# Altium project Dashboard.PrjPcb
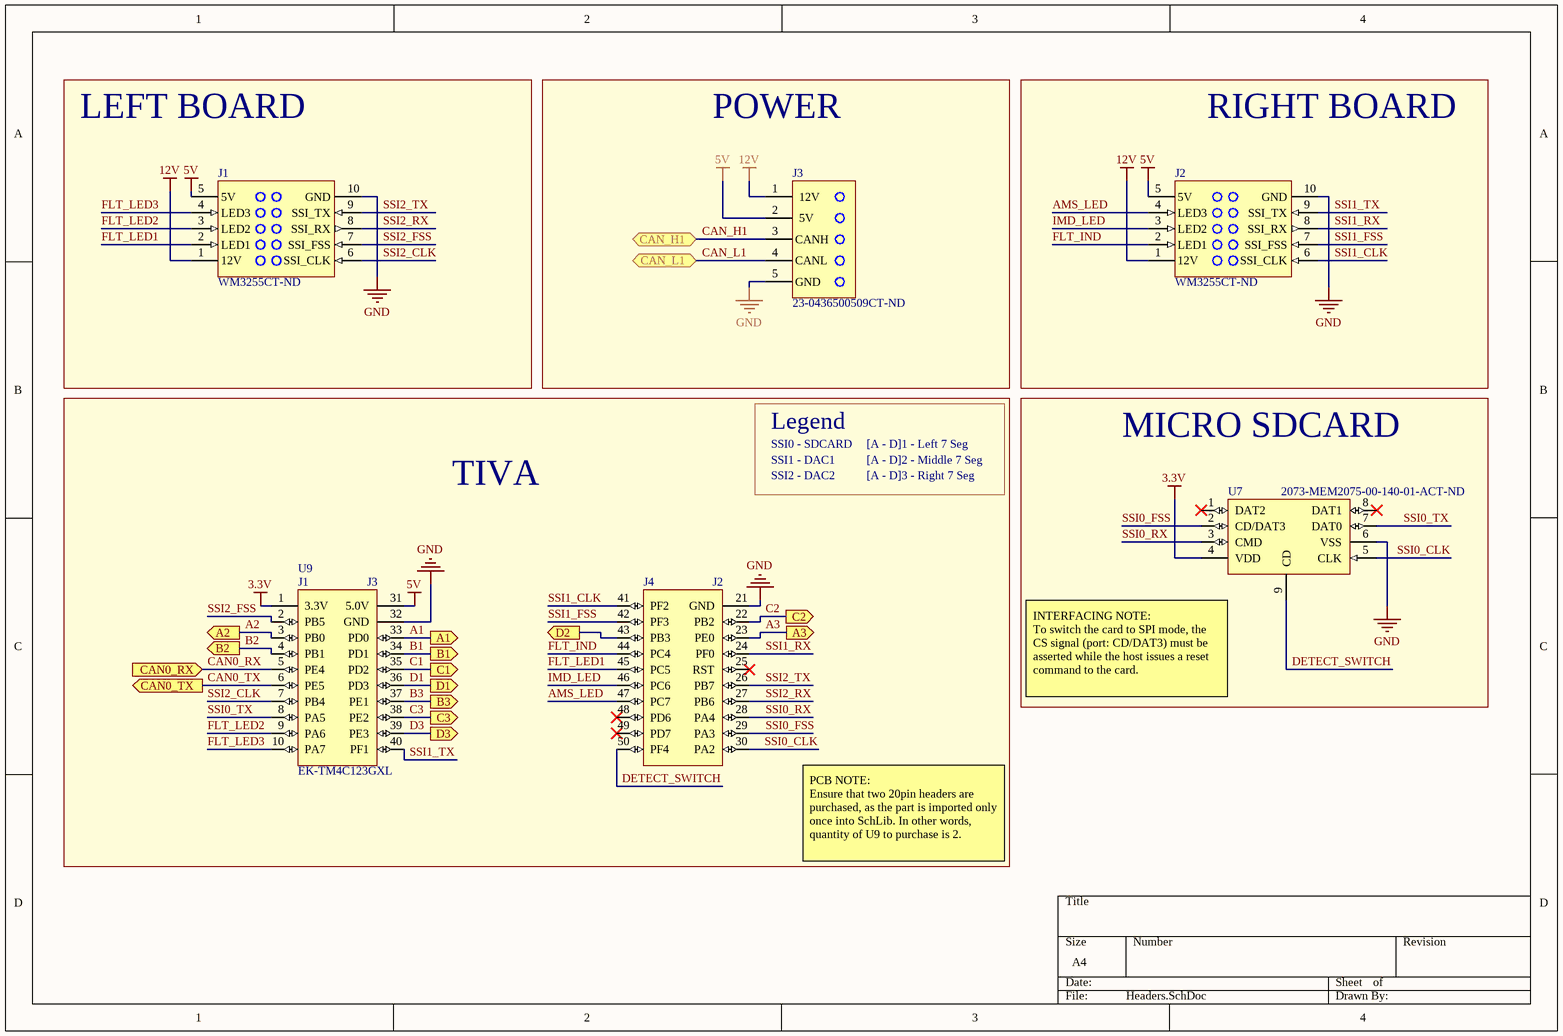
[diagram p0: Headers.SchDoc]
3 sheets, 41 parts. Net scope: global (net labels, ports and power ports of the same name join across sheets).
Board file: Dashboard.PcbDoc
Sheets:
  Headers.SchDoc
  CANTransceiver.SchDoc
  7SegDisplay.SchDoc

## Sheet Headers.SchDoc
size A4

### Parts
J1  WM3255CT-ND  [MOLEX-10PIN]
J2  WM3255CT-ND  [MOLEX-10PIN]
J3  23-0436500509CT-ND  [MOLEX-5PIN]
U7  2073-MEM2075-00-140-01-ACT-ND  [SDCARD-NORMAL]
U9  EK-TM4C123GXL  [TIVA Headers]

### Blocks framed on the sheet
LEFT BOARD: J1
POWER: J3
RIGHT BOARD: J2
TIVA: U9
MICRO SDCARD: U7

### Ports
A1 (out), A2 (out), A3 (out), B1 (out), B2 (out), B3 (out), C1 (out), C2 (out), C3 (out), CAN0_RX (in), CAN0_TX (out), CAN_H1 (bidir), CAN_L1 (bidir), D1 (out), D2 (out), D3 (out)

### Nets
3.3V: U7.4(VDD) U9.1(3.3V)
5V: J1.5(5V) J2.5(5V) J3.2(5V) U9.31(5.0V)
12V: J1.1(12V) J2.1(12V) J3.1(12V)
GND: J1.10(GND) J2.10(GND) J3.5(GND) U7.6(VSS) U9.21(GND) U9.32(GND)
A1: U9.33(PD0) ; port A1
A2: U9.3(PB0) ; port A2
A3: U9.23(PE0) ; port A3
AMS_LED: J2.4(LED3) U9.47(PC7)
B1: U9.34(PD1) ; port B1
B2: U9.4(PB1) ; port B2
B3: U9.37(PE1) ; port B3
C1: U9.35(PD2) ; port C1
C2: U9.22(PB2) ; port C2
C3: U9.38(PE2) ; port C3
CAN0_RX: U9.5(PE4) ; port CAN0_RX
CAN0_TX: U9.6(PE5) ; port CAN0_TX
CAN_H1: J3.3(CANH) ; port CAN_H1
CAN_L1: J3.4(CANL) ; port CAN_L1
D1: U9.36(PD3) ; port D1
D2: U9.43(PB3) ; port D2
D3: U9.39(PE3) ; port D3
DETECT_SWITCH: U7.9(CD) U9.50(PF4)
FLT_IND: J2.2(LED1) U9.44(PC4)
FLT_LED1: J1.2(LED1) U9.45(PC5)
FLT_LED2: J1.3(LED2) U9.9(PA6)
FLT_LED3: J1.4(LED3) U9.10(PA7)
IMD_LED: J2.3(LED2) U9.46(PC6)
SSI0_CLK: U7.5(CLK) U9.30(PA2)
SSI0_FSS: U7.2(CD/DAT3) U9.29(PA3)
SSI0_RX: U7.3(CMD) U9.28(PA4)
SSI0_TX: U7.7(DAT0) U9.8(PA5)
SSI1_CLK: J2.6(SSI_CLK) U9.41(PF2)
SSI1_FSS: J2.7(SSI_FSS) U9.42(PF3)
SSI1_RX: J2.8(SSI_RX) U9.24(PF0)
SSI1_TX: J2.9(SSI_TX) U9.40(PF1)
SSI2_CLK: J1.6(SSI_CLK) U9.7(PB4)
SSI2_FSS: J1.7(SSI_FSS) U9.2(PB5)
SSI2_RX: J1.8(SSI_RX) U9.27(PB6)
SSI2_TX: J1.9(SSI_TX) U9.26(PB7)

Not connected (* = marked no-connect by the designer): U7 1(DAT2)* 8(DAT1)*; U9 25(RST)* 48(PD6)* 49(PD7)*

### Notes on the sheet
- SSI0 - SDCARD
- Legend
- [A - D]1 - Left 7 Seg
- SSI1 - DAC1
- SSI2 - DAC2
- [A - D]2 - Middle 7 Seg
- [A - D]3 - Right 7 Seg
- (near U7) INTERFACING NOTE:
  To switch the card to SPI mode, the CS signal (port: CD/DAT3) must be asserted while the host issues a reset command to the card.
- PCB NOTE:
  Ensure that two 20pin headers are purchased, as the part is imported only once into SchLib. In other words, quantity of U9 to purchase is 2.
- (in symbol PH2-20-UA) J1; J3; J4; J2

### Library data of the parts
J1 J2 = MOLEX-10PIN: HEADER R/A 10POS DUAL TIN SMD; Manufacturer: Molex; Manufacturer Part Number: 0430451006; Contact Resistance: 10mR; Number of Positions: 10; Connector Type: Male Pin; Pitch: 3mm; Row Spacing: 0.118inch; Supplier 1: Digi-Key; Stock 1: 2460; Pricing 1: 1=3.72000, 10=3.57200, 100=2.97680 (USD); RoHS: Yes; Mount: Surface Mount; Contact Plating: Tin; Contact Material: Brass; Color: Black; Housing Material: Polymer; Housing Color: Black; Min Operating Temperature: -40°C; Max Operating Temperature: 105°C; Number of Rows: 2; Packaging: Tape and Reel; Termination: Solder; Number of Contacts: 10; Orientation: Right Angle; Fastening Type: Latch; Length: 19.15mm; Depth: 15.4mm; ComponentLink1URL: https://datasheet.ciiva.com/737/430450407-sd-737953.pdf?src-supplier=Digi-Key; ComponentLink1Description: https://datasheet.ciiva.com/737/430450407-sd-737953.pdf?src-supplier=Digi-Key; Supplier Part Number 1: WM3255CT-ND
J3 = 0436500509: GLOVE, POLYAMIDE, L/FREE, PU, SIZE 6 - More Details; Manufacturer: Molex; Max Voltage Rating (AC): 250V; Number of Contacts: 5; Current Rating: 5A; Voltage Rating: 600V; Gender: Male; Connector Type: Male Pin; Pitch: 3mm; Glow Wire Compliant: Compliant; Supplier 1: Digi-Key; Manufacturer Part Number: 0436500509; Stock 1: 8420; Pricing 1: 1=2.58000, 10=2.34500, 100=2.00970 (USD); RoHS: Yes; Mount: Surface Mount; Contact Plating: Tin; Contact Material: Brass; Color: Black; Housing Color: Black; Housing Material: Polymer; Min Operating Temperature: -40°C; Max Operating Temperature: 105°C; Termination: Solder; Orientation: Right Angle; Number of Rows: 1; Packaging: Tape and Reel; Package Quantity: 10; Fastening Type: Ramp; Contact Gender: Male; Number of Positions: 5; Voltage Rating (DC): 250V; Number of Circuits: 5; Halogen Free: Low Halogen; ComponentLink1URL: https://datasheet.ciiva.com/712/436501209-sd-712211.pdf?src-supplier=Digi-Key; ComponentLink1Description: https://datasheet.ciiva.com/712/436501209-sd-712211.pdf?src-supplier=Digi-Key; ComponentLink2URL: https://datasheet.ciiva.com/16089/0436500509-pcb-headers-16089055.pdf?src-supplier=Onlinecomponents.com; ComponentLink2Description: https://datasheet.ciiva.com/16089/0436500509-pcb-headers-16089055.pdf?src-supplier=Onlinecomponents.com; Supplier Part Number 1: 23-0436500509CT-ND
U7 = SDCARD CONN.: 850NM POINT SOURCE LED ASSY; Manufacturer: Global Connector Technology; Supplier 1: Newark; Manufacturer Part Number: MEM2075-00-140-01-A; Stock 1: 1028; Pricing 1: 1=1.68000, 10=1.53000, 25=1.53000, 50=1.53000, 100=1.42000, 250=1.42000, 500=1.32000, 1000=1.23000, 1=1.26000, 10=1.15000, 25=1.15000, 50=1.15000, 100=1.07000, 250=1.07000, 500=0.98600, 1000=0.92000 (CAD); RoHS: No; Supplier Part Number 1: 56AC1963
U9 = PH2-20-UA: PH Series 20 Position Through-Hole Dual Row Straight .100 Header; Manufacturer: Adam Equipment; Number of Positions: 20; Pitch: 2.54mm; Supplier 1: Digi-Key; Manufacturer Part Number: PH2-20-UA; Stock 1: 6280; Pricing 1: 1=0.26000, 10=0.24700, 100=0.17300, 500=0.14826, 1000=0.12355, 5000=0.10590, 10000=0.09884 (USD); RoHS: Yes; Mount: Through Hole; Contact Plating: Gold; Termination: Solder; Packaging: Bag; Lead Free: Lead Free; ComponentLink1URL: https://datasheet.ciiva.com/16479/page-312-315-16479356.pdf?src-supplier=Future+Electronics; ComponentLink1Description: https://datasheet.ciiva.com/16479/page-312-315-16479356.pdf?src-supplier=Future+Electronics; Supplier Part Number 1: 2057-PH2-20-UA-ND

## Sheet CANTransceiver.SchDoc
size A4
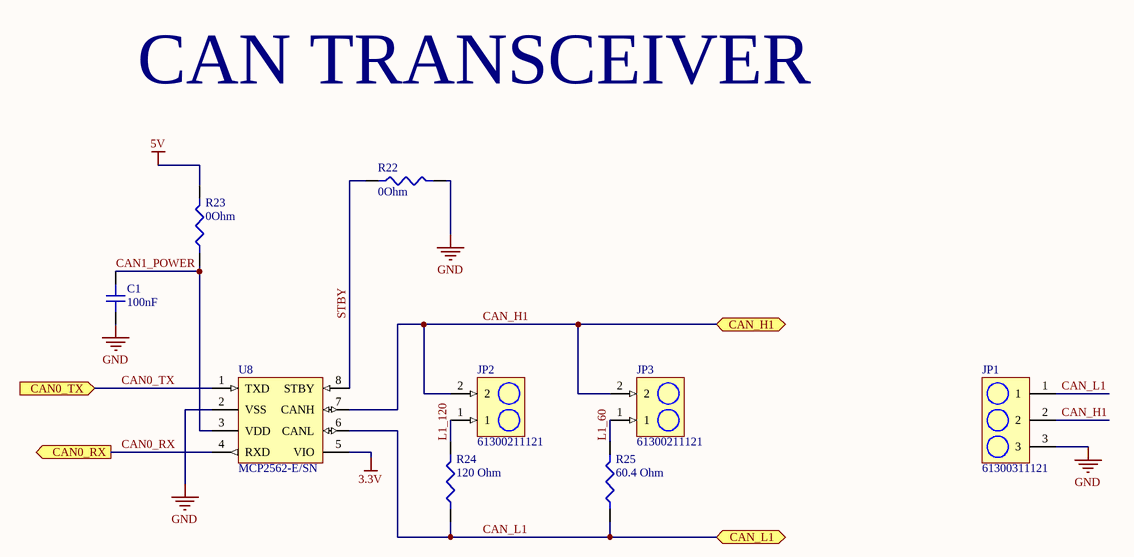
[diagram p1: CANTransceiver.SchDoc]

### Parts
C1  100nF  [CAPC1608X10N]
JP1  61300311121  [61300311121]
JP2  61300211121  [61300211121]
JP3  61300211121  [61300211121]
R22  0Ohm  [RES-0603]
R23  0Ohm  [RES-0603]
R24  120 Ohm  [RESC1608X06N]
R25  60.4 Ohm  [60.4 OHM RES 0603]
U8  MCP2562-E/SN  [SOIC127P600X175-8N]

### Ports
CAN0_RX (out), CAN0_TX (in), CAN_H1 (bidir), CAN_L1 (bidir)

### Nets
3.3V: U8.5(VIO)
5V: R23.2
GND: C1.1 JP1.3 R22.2 U8.2(VSS)
CAN0_RX: U8.4(RXD) ; port CAN0_RX
CAN0_TX: U8.1(TXD) ; port CAN0_TX
CAN1_POWER: C1.2 R23.1 U8.3(VDD)
CAN_H1: JP1.2 JP2.2 JP3.2 U8.7(CANH) ; port CAN_H1
CAN_L1: JP1.1 R24.1 R25.1 U8.6(CANL) ; port CAN_L1
L1_60: JP3.1 R25.2
L1_120: JP2.1 R24.2
STBY: R22.1 U8.8(STBY)

### Notes on the sheet
- CAN TRANSCEIVER

### Library data of the parts
C1 = C0603C104K4RAC7411: Cap Ceramic 0.1uF 16V X7R 10% SMD 0603 125C Paper T/R; Manufacturer: KEMET; Dissipation Factor: 3.5%; Supplier 1: Digi-Key; Manufacturer Part Number: C0603C104K4RAC7411; Stock 1: 26049; Pricing 1: 1=0.14000, 10=0.09800, 100=0.04620, 500=0.03240, 1000=0.02683, 2500=0.02497, 5000=0.02285 (USD); RoHS: Yes; Mount: Surface Mount; Case/Package: 0603; Case Code (Imperial): 0603; Case Code (Metric): 1608; Dielectric Material: Ceramic; Min Operating Temperature: -55°C; Max Operating Temperature: 125°C; Tolerance: 10%; Packaging: Tape and Reel; Capacitance: 100nF; Package Quantity: 10000; Voltage Rating: 16V; Voltage Rating (DC): 16V; Dielectric: X7R; Termination: SMD/SMT; Length: 1.6mm; Height: 0.8mm; Width: 0.8mm; Lead Pitch: 0.7mm; Depth: 0.8mm; Radiation Hardening: No; ComponentLink1URL: https://datasheet.ciiva.com/5411/kem-c1002-x7r-smd-357932-5411657.pdf?src-supplier=Mouser; ComponentLink1Description: https://datasheet.ciiva.com/5411/kem-c1002-x7r-smd-357932-5411657.pdf?src-supplier=Mouser; Supplier Part Number 1: 399-17393-1-ND
JP1 = 61300311121: WURTH ELEKTRONIK - 61300311121 - HEADER, 2.54MM, PIN, THT, VERTICAL, 3WAY; Manufacturer: Wurth Electronics; Number of Positions: 3; Gender: Male; Connector Type: Male Pin; Pitch: 0.1inch; Supplier 1: Digi-Key; Manufacturer Part Number: 61300311121; Stock 1: 56311; Pricing 1: 1=0.13000, 10=0.10600, 25=0.08800, 50=0.07400, 100=0.06700, 1000=0.06100 (USD); RoHS: Yes; Mount: Through Hole; Contact Plating: Gold; Contact Material: Copper; Color: Black; Number of Rows: 1; Packaging: Bulk; Termination: Solder; Number of Contacts: 3; Contact Mating Length: 0.236inch; REACH SVHC: Unknown; Lead Free: Lead Free; ComponentLink1URL: http://www.farnell.com/cad/1737268.pdf?src-supplier=Element14; ComponentLink1Description: http://www.farnell.com/cad/1737268.pdf?src-supplier=Element14; ComponentLink2URL: https://katalog.we-online.de/em/datasheet/6130xx11121.pdf?src-supplier=Digi-Key; ComponentLink2Description: https://katalog.we-online.de/em/datasheet/6130xx11121.pdf?src-supplier=Digi-Key; Supplier Part Number 1: 732-5316-ND
JP2 JP3 = 61300211121: Headers & Wire Housings WR-PHD 2.54mm 2Pin THT Header; Manufacturer: Wurth Electronics; Current Rating: 3A; Voltage Rating: 250V; Number of Positions: 2; Gender: Male; Connector Type: Male Pin; Pitch: 0.1inch; Supplier 1: Digi-Key; Manufacturer Part Number: 61300211121; Stock 1: 191551; Pricing 1: 1=0.13000, 10=0.10600, 25=0.08800, 50=0.07400, 100=0.06700, 1000=0.06100 (USD); RoHS: Yes; Mount: Through Hole; Contact Plating: Gold; Housing Material: PBT; Contact Material: Copper Alloy,Copper; Color: Black; Min Operating Temperature: -40°C; Max Operating Temperature: 125°C; Number of Rows: 1; Contact Gender: Male; Packaging: Bulk; Termination: Through Hole; Number of Contacts: 2; Contact Mating Length: 0.236inch; REACH SVHC: Unknown; Lead Free: Lead Free; ComponentLink1URL: https://datasheet.ciiva.com/13619/6130xx11121-48870-13619345.pdf?src-supplier=Mouser; ComponentLink1Description: https://datasheet.ciiva.com/13619/6130xx11121-48870-13619345.pdf?src-supplier=Mouser; Supplier Part Number 1: 732-5315-ND
R22 R23 = RC0603JR-070RL: RES SMD 0 OHM JUMPER 1/10W 0603; Manufacturer: Yageo; Resistance: 0mR; Tolerance: 1%; Voltage Rating: 50V; Power Rating: 100mW; Temperature Coefficient: 200ppm/°C; Supplier 1: Digi-Key; Manufacturer Part Number: RC0603JR-070RL; Stock 1: 36135548; Pricing 1: 1=0.10000, 10=0.01900, 25=0.01360, 50=0.01040, 100=0.00770, 250=0.00588, 500=0.00472, 1000=0.00347 (USD); RoHS: Yes; Case/Package: 0603; Number of Pins: 2; Case Code (Imperial): 0603; Case Code (Metric): 1608; Contact Plating: Tin,Matte; Min Operating Temperature: -55°C; Max Operating Temperature: 155°C; Package Quantity: 5000; Packaging: Tape and Reel; Voltage Rating (DC): 50V; Termination: SMD/SMT; Composition: Thick Film; Military Standard: Not; Length: 1.6mm; Height: 0.45mm; Width: 0.8mm; Depth: 0.8mm; Radiation Hardening: No; REACH SVHC: No SVHC; Lead Free: Lead Free; ComponentLink1URL: https://datasheet.ciiva.com/11808/pyu-r-int-6-11808700.pdf?src-supplier=RSComponents; ComponentLink1Description: https://datasheet.ciiva.com/11808/pyu-r-int-6-11808700.pdf?src-supplier=RSComponents; ComponentLink2URL: https://datasheet.ciiva.com/7746/1738695-7746421.pdf?src-supplier=Element14; ComponentLink2Description: https://datasheet.ciiva.com/7746/1738695-7746421.pdf?src-supplier=Element14; ComponentLink3URL: https://datasheet.ciiva.com/8883/pyu-rc0603-51-rohs-l-4-8883045.pdf?src-supplier=Avnet; ComponentLink3Description: https://datasheet.ciiva.com/8883/pyu-rc0603-51-rohs-l-4-8883045.pdf?src-supplier=Avnet; ComponentLink4URL: https://datasheet.ciiva.com/15189/getdatasheetpartid-329462-15189845.pdf?src-supplier=Verical; ComponentLink4Description: https://datasheet.ciiva.com/15189/getdatasheetpartid-329462-15189845.pdf?src-supplier=Verical; ComponentLink5URL: https://datasheet.ciiva.com/7746/1738695-7746422.pdf?src-supplier=Element14; ComponentLink5Description: https://datasheet.ciiva.com/7746/1738695-7746422.pdf?src-supplier=Element14; ComponentLink6URL: https://datasheet.ciiva.com/12555/rc0603-272842-12555254.pdf?src-supplier=Mouser; ComponentLink6Description: https://datasheet.ciiva.com/12555/rc0603-272842-12555254.pdf?src-supplier=Mouser; ComponentLink7URL: https://datasheet.ciiva.com/22747/443971-22747530.pdf?src-supplier=Element14; ComponentLink7Description: https://datasheet.ciiva.com/22747/443971-22747530.pdf?src-supplier=Element14; Supplier Part Number 1: 311-0.0GRCT-ND
R24 = ERA-3AEB121V: Metal film resistor 120 Ω SMD 0603 0.1 W; Manufacturer: Panasonic; Resistance: 120R; Power Rating: 100mW; Tolerance: 0.1%; Voltage Rating: 75V; Temperature Coefficient: 25ppm/°C; Supplier 1: Digi-Key; Manufacturer Part Number: ERA-3AEB121V; Stock 1: 121177; Pricing 1: 1=0.35000, 10=0.30000, 100=0.11730, 1000=0.04908, 2500=0.04499 (USD); RoHS: Yes; Mount: Surface Mount; Case/Package: 0603; Number of Pins: 2; Case Code (Metric): 1608; Case Code (Imperial): 0603; Contact Plating: Tin; Min Operating Temperature: -55°C; Max Operating Temperature: 155°C; Packaging: Tape and Reel; Package Quantity: 1; Composition: Thin Film; Number of Terminations: 2; Termination: SMD/SMT; Military Standard: Not; Max Power Dissipation: 100mW; Voltage Rating (DC): 75V; Features: Automotive AEC-Q200; Length: 1.6mm; Height: 0.45mm; Width: 0.8mm; Depth: 0.8mm; Radiation Hardening: No; REACH SVHC: No SVHC; Lead Free: Lead Free; ComponentLink1URL: https://datasheet.ciiva.com/11808/0900766b80fe20f7-11808026.pdf?src-supplier=RSComponents; ComponentLink1Description: https://datasheet.ciiva.com/11808/0900766b80fe20f7-11808026.pdf?src-supplier=RSComponents; ComponentLink2URL: https://datasheet.ciiva.com/22737/1776116-22737254.pdf?src-supplier=Element14; ComponentLink2Description: https://datasheet.ciiva.com/22737/1776116-22737254.pdf?src-supplier=Element14; ComponentLink3URL: https://datasheet.ciiva.com/30214/54aoa0000ce26-30214359.pdf?src-supplier=Onlinecomponents.com; ComponentLink3Description: https://datasheet.ciiva.com/30214/54aoa0000ce26-30214359.pdf?src-supplier=Onlinecomponents.com; ComponentLink4URL: https://datasheet.ciiva.com/48425/era-eng-tds-48425415.pdf?src-supplier=Distrelec; ComponentLink4Description: https://datasheet.ciiva.com/48425/era-eng-tds-48425415.pdf?src-supplier=Distrelec; ComponentLink5URL: https://datasheet.ciiva.com/5999/485442-5999048.pdf?src-supplier=Farnell; ComponentLink5Description: https://datasheet.ciiva.com/5999/485442-5999048.pdf?src-supplier=Farnell; ComponentLink6URL: https://datasheet.ciiva.com/43455/485442-43455209.pdf?src-supplier=Farnell; ComponentLink6Description: https://datasheet.ciiva.com/43455/485442-43455209.pdf?src-supplier=Farnell; ComponentLink7URL: https://datasheet.ciiva.com/43457/485442-43457753.pdf?src-supplier=Farnell; ComponentLink7Description: https://datasheet.ciiva.com/43457/485442-43457753.pdf?src-supplier=Farnell; ComponentLink8URL: https://datasheet.ciiva.com/48534/era-eng-tds-48534505.pdf?src-supplier=Distrelec; ComponentLink8Description: https://datasheet.ciiva.com/48534/era-eng-tds-48534505.pdf?src-supplier=Distrelec; ComponentLink9URL: https://datasheet.ciiva.com/5999/485442-5999050.pdf?src-supplier=Farnell; ComponentLink9Description: https://datasheet.ciiva.com/5999/485442-5999050.pdf?src-supplier=Farnell; ComponentLink10URL: https://datasheet.ciiva.com/9117/aoa0000ce26-9117338.pdf?src-supplier=Avnet; ComponentLink10Description: https://datasheet.ciiva.com/9117/aoa0000ce26-9117338.pdf?src-supplier=Avnet; ComponentLink11URL: https://datasheet.ciiva.com/9186/aoa0000ce26-9186155.pdf?src-supplier=Avnet; ComponentLink11Description: https://datasheet.ciiva.com/9186/aoa0000ce26-9186155.pdf?src-supplier=Avnet; Supplier Part Number 1: P120DBCT-ND
R25 = RMCF0603FT60R4: RES 60.4 OHM 1% 1/10W 0603; Manufacturer: Stackpole Electronics; Resistance: 60.4R; Max Power Dissipation: 100mW; Temperature Coefficient: 100ppm/°C; Supplier 1: Digi-Key; Manufacturer Part Number: RMCF0603FT60R4; Stock 1: 27338; Pricing 1: 1=0.10000, 10=0.01600, 100=0.00650, 1000=0.00292, 2500=0.00253 (USD); RoHS: Yes; Mount: Surface Mount; Case/Package: 0603; Case Code (Metric): 1608; Case Code (Imperial): 0603; Contact Plating: Tin,Matte; Min Operating Temperature: -55°C; Max Operating Temperature: 155°C; Packaging: Tape and Reel; Tolerance: 1%; Composition: Thick Film; Number of Terminations: 2; Features: Automotive AEC-Q200; Length: 0.061inch; Height: 0.022inch; Width: 0.031inch; Radiation Hardening: No; Lead Free: Lead Free; ComponentLink1URL: http://components.arrow.com/part/dataview/50499519S121523N1174?src-supplier=Arrow; ComponentLink1Description: http://components.arrow.com/part/dataview/50499519S121523N1174?src-supplier=Arrow; ComponentLink2URL: https://www.seielect.com/catalog/SEI-RMCF_RMCP.pdf?src-supplier=Avnet; ComponentLink2Description: https://www.seielect.com/catalog/SEI-RMCF_RMCP.pdf?src-supplier=Avnet; ComponentLink3URL: https://www.seielect.com/catalog/SEI-Packaging.pdf?src-supplier=Digi-Key; ComponentLink3Description: https://www.seielect.com/catalog/SEI-Packaging.pdf?src-supplier=Digi-Key; Supplier Part Number 1: RMCF0603FT60R4CT-ND
U8 = MCP2562-E/SN: Interface IC CAN SO-8; Manufacturer: Microchip; Number of Transmit Buffers: 1; Min Supply Voltage: 4.5V; Max Supply Voltage: 5.5V; Data Rate: 1Mbps; Nominal Supply Current: 70mA; Propagation Delay: 125ns; Interface: CAN,LIN; Logic Function: Transceiver; Supplier 1: Digi-Key; Manufacturer Part Number: MCP2562-E/SN; Stock 1: 3084; Pricing 1: 1=0.90000, 25=0.75000, 100=0.68000 (USD); RoHS: Yes; Mount: Surface Mount; Case/Package: SOIC; Number of Pins: 8; Min Operating Temperature: -40°C; Max Operating Temperature: 125°C; Number of Receive Buffers: 1; Packaging: Rail/Tube; Number of Receivers: 1; Package Quantity: 100; Turn-On Delay Time: 125ns; Number of Transceivers: 1; Max Supply Current: 70mA; Number of Drivers: 1; Length: 4.9mm; Height: 1.5mm; Width: 3.9mm; Radiation Hardening: No; REACH SVHC: No SVHC; Lead Free: Lead Free; ComponentLink1URL: https://datasheet.ciiva.com/26922/getdatasheetpartid-776214-26922473.pdf?src-supplier=Verical; ComponentLink1Description: https://datasheet.ciiva.com/26922/getdatasheetpartid-776214-26922473.pdf?src-supplier=Verical; ComponentLink2URL: https://datasheet.ciiva.com/24192/filehandler-aspxddocname-en561044-24192158.pdf?src-supplier=Future+Electronics; ComponentLink2Description: https://datasheet.ciiva.com/24192/filehandler-aspxddocname-en561044-24192158.pdf?src-supplier=Future+Electronics; ComponentLink3URL: https://datasheet.ciiva.com/39123/21125167b-39123503.pdf?src-supplier=Onlinecomponents.com; ComponentLink3Description: https://datasheet.ciiva.com/39123/21125167b-39123503.pdf?src-supplier=Onlinecomponents.com; ComponentLink4URL: https://datasheet.ciiva.com/22747/1755821-22747911.pdf?src-supplier=Element14; ComponentLink4Description: https://datasheet.ciiva.com/22747/1755821-22747911.pdf?src-supplier=Element14; ComponentLink5URL: https://datasheet.ciiva.com/18624/25167b-18624808.pdf?src-supplier=Digi-Key; ComponentLink5Description: https://datasheet.ciiva.com/18624/25167b-18624808.pdf?src-supplier=Digi-Key; ComponentLink6URL: https://datasheet.ciiva.com/29898/25167b-29898006.pdf?src-supplier=Avnet; ComponentLink6Description: https://datasheet.ciiva.com/29898/25167b-29898006.pdf?src-supplier=Avnet; ComponentLink7URL: https://datasheet.ciiva.com/48512/mcp2562-eng-tds-48512071.pdf?src-supplier=Distrelec; ComponentLink7Description: https://datasheet.ciiva.com/48512/mcp2562-eng-tds-48512071.pdf?src-supplier=Distrelec; Supplier Part Number 1: MCP2562-E/SN-ND

## Sheet 7SegDisplay.SchDoc
size A4
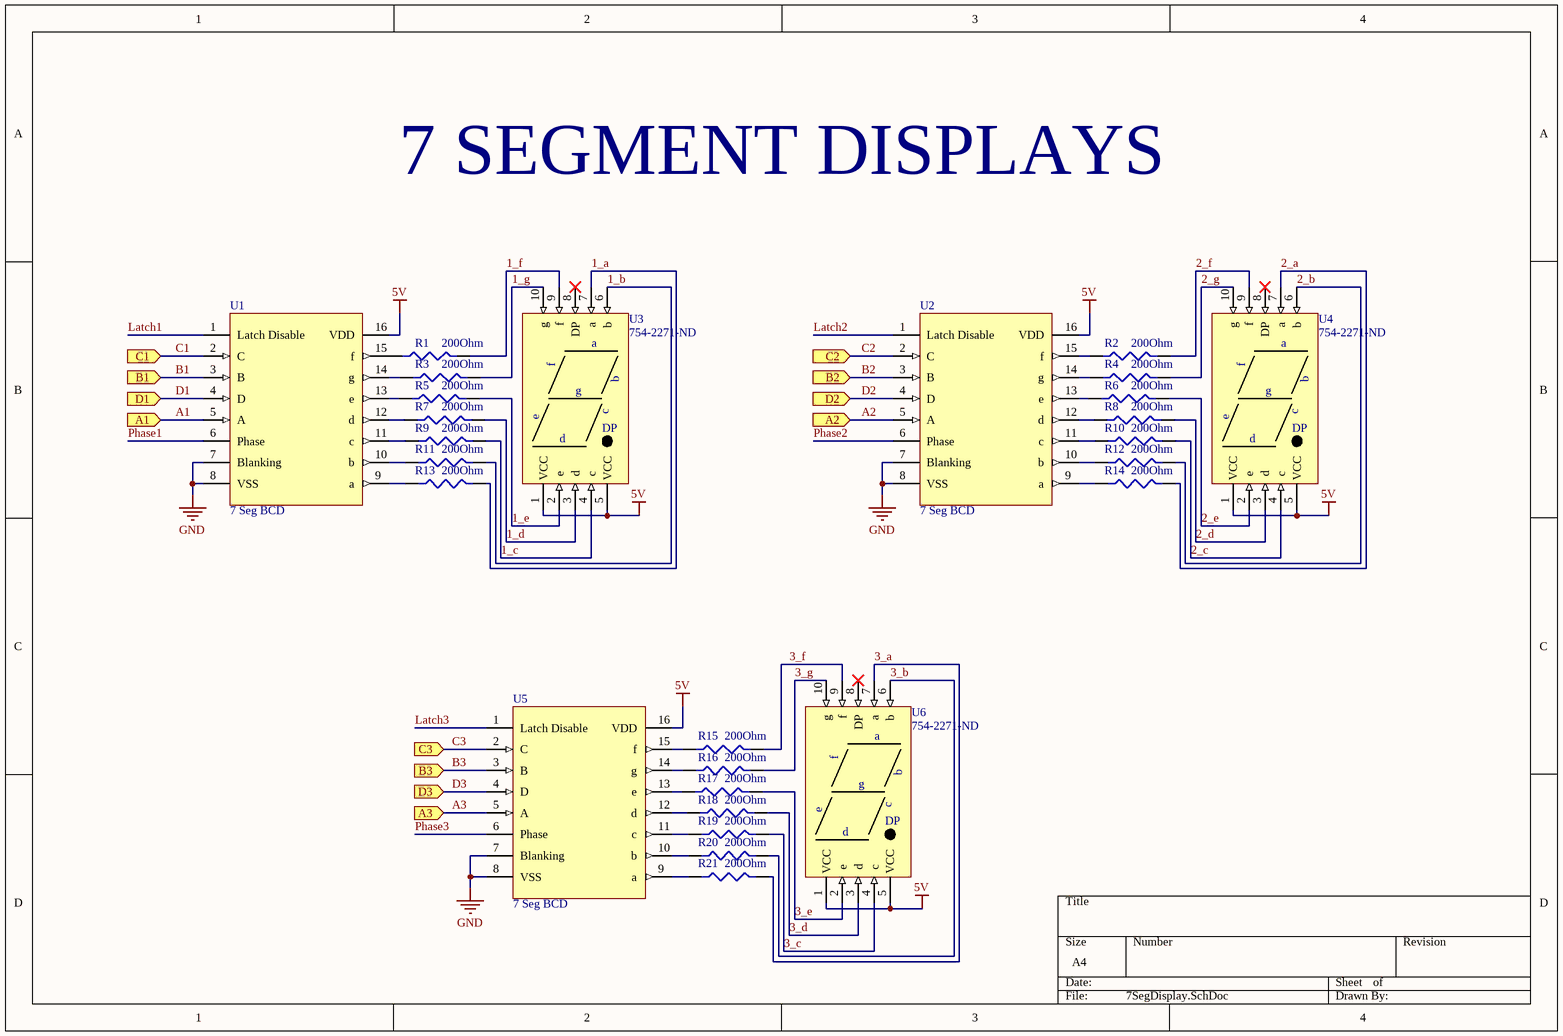
[diagram p2: 7SegDisplay.SchDoc]

### Parts
R1  200Ohm  [RES-0805]
R2  200Ohm  [RES-0805]
R3  200Ohm  [RES-0805]
R4  200Ohm  [RES-0805]
R5  200Ohm  [RES-0805]
R6  200Ohm  [RES-0805]
R7  200Ohm  [RES-0805]
R8  200Ohm  [RES-0805]
R9  200Ohm  [RES-0805]
R10  200Ohm  [RES-0805]
R11  200Ohm  [RES-0805]
R12  200Ohm  [RES-0805]
R13  200Ohm  [RES-0805]
R14  200Ohm  [RES-0805]
R15  200Ohm  [RES-0805]
R16  200Ohm  [RES-0805]
R17  200Ohm  [RES-0805]
R18  200Ohm  [RES-0805]
R19  200Ohm  [RES-0805]
R20  200Ohm  [RES-0805]
R21  200Ohm  [RES-0805]
U1  7 Seg BCD  [TSOP65P640X120-16N]
U2  7 Seg BCD  [TSOP65P640X120-16N]
U3  754-2271-ND  [SA15-11EWA]
U4  754-2271-ND  [SA15-11EWA]
U5  7 Seg BCD  [TSOP65P640X120-16N]
U6  754-2271-ND  [SA15-11EWA]

### Ports
A1 (in), A2 (in), A3 (in), B1 (in), B2 (in), B3 (in), C1 (in), C2 (in), C3 (in), D1 (in), D2 (in), D3 (in)

### Nets
5V: U1.16(VDD) U2.16(VDD) U3.1(VCC) U3.5(VCC) U4.1(VCC) U4.5(VCC) U5.16(VDD) U6.1(VCC) U6.5(VCC)
GND: U1.7(Blanking) U1.8(VSS) U2.7(Blanking) U2.8(VSS) U5.7(Blanking) U5.8(VSS)
1_a: R13.2 U3.7(a)
1_b: R11.2 U3.6(b)
1_c: R9.2 U3.4(c)
1_d: R7.2 U3.3(d)
1_e: R5.2 U3.2(e)
1_f: R1.2 U3.9(f)
1_g: R3.2 U3.10(g)
2_a: R14.2 U4.7(a)
2_b: R12.2 U4.6(b)
2_c: R10.2 U4.4(c)
2_d: R8.2 U4.3(d)
2_e: R6.2 U4.2(e)
2_f: R2.2 U4.9(f)
2_g: R4.2 U4.10(g)
3_a: R21.2 U6.7(a)
3_b: R20.2 U6.6(b)
3_c: R19.2 U6.4(c)
3_d: R18.2 U6.3(d)
3_e: R17.2 U6.2(e)
3_f: R15.2 U6.9(f)
3_g: R16.2 U6.10(g)
A1: U1.5(A) ; port A1
A2: U2.5(A) ; port A2
A3: U5.5(A) ; port A3
B1: U1.3(B) ; port B1
B2: U2.3(B) ; port B2
B3: U5.3(B) ; port B3
C1: U1.2(C) ; port C1
C2: U2.2(C) ; port C2
C3: U5.2(C) ; port C3
D1: U1.4(D) ; port D1
D2: U2.4(D) ; port D2
D3: U5.4(D) ; port D3
Latch1: U1.1(Latch_Disable)
Latch2: U2.1(Latch_Disable)
Latch3: U5.1(Latch_Disable)
Phase1: U1.6(Phase)
Phase2: U2.6(Phase)
Phase3: U5.6(Phase)
NetR1_1: R1.1 U1.15(f)
NetR2_1: R2.1 U2.15(f)
NetR3_1: R3.1 U1.14(g)
NetR4_1: R4.1 U2.14(g)
NetR5_1: R5.1 U1.13(e)
NetR6_1: R6.1 U2.13(e)
NetR7_1: R7.1 U1.12(d)
NetR8_1: R8.1 U2.12(d)
NetR9_1: R9.1 U1.11(c)
NetR10_1: R10.1 U2.11(c)
NetR11_1: R11.1 U1.10(b)
NetR12_1: R12.1 U2.10(b)
NetR13_1: R13.1 U1.9(a)
NetR14_1: R14.1 U2.9(a)
NetR15_1: R15.1 U5.15(f)
NetR16_1: R16.1 U5.14(g)
NetR17_1: R17.1 U5.13(e)
NetR18_1: R18.1 U5.12(d)
NetR19_1: R19.1 U5.11(c)
NetR20_1: R20.1 U5.10(b)
NetR21_1: R21.1 U5.9(a)

Not connected (* = marked no-connect by the designer): U3 8(DP)*; U4 8(DP)*; U6 8(DP)*

### Notes on the sheet
- 7 SEGMENT DISPLAYS

### Library data of the parts
R1-R21 = RNCP0805FTD200R: RES SMD 200 OHM 1% 1/4W 0805; Manufacturer: Stackpole Electronics; Resistance: 200R; Max Power Dissipation: 250mW; Temperature Coefficient: 100ppm/°C; Supplier 1: Digi-Key; Manufacturer Part Number: RNCP0805FTD200R; Stock 1: 80873; Pricing 1: 1=0.10000, 10=0.07200, 100=0.02770, 1000=0.01220, 2500=0.01053 (USD); RoHS: Yes; Mount: Surface Mount; Case/Package: 0805; Case Code (Metric): 2012; Case Code (Imperial): 0805; Min Operating Temperature: -55°C; Max Operating Temperature: 155°C; Packaging: Tape and Reel; Composition: Thin Film; Number of Terminations: 2; Tolerance: 1%; Features: Moisture Resistant,Anti-Sulfur; Length: 0.079inch; Height: 0.024inch; Width: 0.049inch; ComponentLink1URL: http://www.seielect.com/Catalog/SEI-rncp.pdf?src-supplier=Digi-Key; ComponentLink1Description: http://www.seielect.com/Catalog/SEI-rncp.pdf?src-supplier=Digi-Key; ComponentLink2URL: https://www.seielect.com/catalog/SEI-Packaging.pdf?src-supplier=Digi-Key; ComponentLink2Description: https://www.seielect.com/catalog/SEI-Packaging.pdf?src-supplier=Digi-Key; ComponentLink3URL: https://www.seielect.com/Catalog/SEI-rncp.pdf?src-supplier=Avnet; ComponentLink3Description: https://www.seielect.com/Catalog/SEI-rncp.pdf?src-supplier=Avnet; Supplier Part Number 1: RNCP0805FTD200RCT-ND
U1 U2 U5 = CD4543BPWR: IC BCD7SEG LCH/DECD/DRVR 16TSSOP; Manufacturer: Texas Instruments; Number of Inputs: 4; Number of Outputs: 7; Propagation Delay: 400ns; Max Supply Voltage: 18V; Min Supply Voltage: 3V; Number of Elements: 1; Logic Function: Demultiplexer,Decoder; Polarity: Non-Inverting; Turn-On Delay Time: 1200ns; High Level Output Current: -3.33mA; Low Level Output Current: 4.2mA; Quiescent Current: 100uA; Display Type: LCD; Operating Supply Current: 40nA; Bandwidth: 8MHz; Supplier 1: Digi-Key; Manufacturer Part Number: CD4543BPWR; Stock 1: 1809; Pricing 1: 1=0.42000, 10=0.35900, 100=0.26820, 500=0.21074, 1000=0.16284 (USD); RoHS: Yes; Case/Package: TSSOP; Number of Pins: 16; Weight: 0.002183oz; Contact Plating: Gold; Min Operating Temperature: -55°C; Max Operating Temperature: 125°C; Packaging: Tape and Reel; Package Quantity: 1; Min Input Voltage: 3V; Number of Input Lines: 4; Number of Output Lines: 7; Number of Bits: 7; Number of Channels: 4; Lead Free: Lead Free; ComponentLink1URL: https://datasheet.ciiva.com/14294/cd4543b-14294665.pdf?src-supplier=Avnet; ComponentLink1Description: https://datasheet.ciiva.com/14294/cd4543b-14294665.pdf?src-supplier=Avnet; ComponentLink2URL: https://datasheet.ciiva.com/1940/cd4543b-1940490.pdf?src-supplier=Digi-Key; ComponentLink2Description: https://datasheet.ciiva.com/1940/cd4543b-1940490.pdf?src-supplier=Digi-Key; ComponentLink3URL: https://datasheet.ciiva.com/1940/cd4543b-1940491.pdf?src-supplier=Digi-Key; ComponentLink3Description: https://datasheet.ciiva.com/1940/cd4543b-1940491.pdf?src-supplier=Digi-Key; ComponentLink4URL: https://datasheet.ciiva.com/1940/cd4543b-1940492.pdf?src-supplier=Digi-Key; ComponentLink4Description: https://datasheet.ciiva.com/1940/cd4543b-1940492.pdf?src-supplier=Digi-Key; Supplier Part Number 1: 296-17106-1-ND
U3 U4 U6 = SA15-11EWA: DISPLAY, SEVEN SEGMENT, 47MM, RED, COMMON ANODE; Manufacturer: Kingbright; Number of Characters: 1; Max Power Dissipation: 150mW; Forward Current: 30mA; Forward Voltage: 4V; Operating Supply Voltage: 2V; Wavelength: 625nm; Luminous Intensity: 16mcd; Test Current: 20mA; Supplier 1: Digi-Key; Manufacturer Part Number: SA15-11EWA; Stock 1: 760; Pricing 1: 1=3.36000, 10=2.80000, 100=1.96000, 500=1.62400 (USD); RoHS: Yes; Case/Package: DIP; Color: Red; Min Operating Temperature: -40°C; Max Operating Temperature: 85°C; Package Quantity: 15; Packaging: Rail/Tube; Element Configuration: Common Anode; Illumination Color: Red; Height: 1.85inch; Width: 1.306inch; REACH SVHC: No SVHC; ComponentLink1URL: https://datasheet.ciiva.com/2105/sa15-11ewa-2105137.pdf?src-supplier=Digi-Key; ComponentLink1Description: https://datasheet.ciiva.com/2105/sa15-11ewa-2105137.pdf?src-supplier=Digi-Key; ComponentLink2URL: https://datasheet.ciiva.com/4421/sa15-11ewa-49819-4421892.pdf?src-supplier=Mouser; ComponentLink2Description: https://datasheet.ciiva.com/4421/sa15-11ewa-49819-4421892.pdf?src-supplier=Mouser; ComponentLink3URL: https://datasheet.ciiva.com/1230/57137-1230472.pdf?src-supplier=Element14; ComponentLink3Description: https://datasheet.ciiva.com/1230/57137-1230472.pdf?src-supplier=Element14; ComponentLink4URL: https://datasheet.ciiva.com/1230/28421-1230493.pdf?src-supplier=Element14; ComponentLink4Description: https://datasheet.ciiva.com/1230/28421-1230493.pdf?src-supplier=Element14; Supplier Part Number 1: 754-2271-ND

## Nets that join several sheets
3.3V: Headers (U7.4 U9.1), CANTransceiver (U8.5)
5V: Headers (J1.5 J2.5 J3.2 U9.31), CANTransceiver (R23.2), 7SegDisplay (9 pins)
GND: Headers (6 pins), CANTransceiver (C1.1 JP1.3 R22.2 U8.2), 7SegDisplay (6 pins)
A1: Headers (U9.33), 7SegDisplay (U1.5)
A2: Headers (U9.3), 7SegDisplay (U2.5)
A3: Headers (U9.23), 7SegDisplay (U5.5)
B1: Headers (U9.34), 7SegDisplay (U1.3)
B2: Headers (U9.4), 7SegDisplay (U2.3)
B3: Headers (U9.37), 7SegDisplay (U5.3)
C1: Headers (U9.35), 7SegDisplay (U1.2)
C2: Headers (U9.22), 7SegDisplay (U2.2)
C3: Headers (U9.38), 7SegDisplay (U5.2)
CAN0_RX: Headers (U9.5), CANTransceiver (U8.4)
CAN0_TX: Headers (U9.6), CANTransceiver (U8.1)
CAN_H1: Headers (J3.3), CANTransceiver (JP1.2 JP2.2 JP3.2 U8.7)
CAN_L1: Headers (J3.4), CANTransceiver (JP1.1 R24.1 R25.1 U8.6)
D1: Headers (U9.36), 7SegDisplay (U1.4)
D2: Headers (U9.43), 7SegDisplay (U2.4)
D3: Headers (U9.39), 7SegDisplay (U5.4)